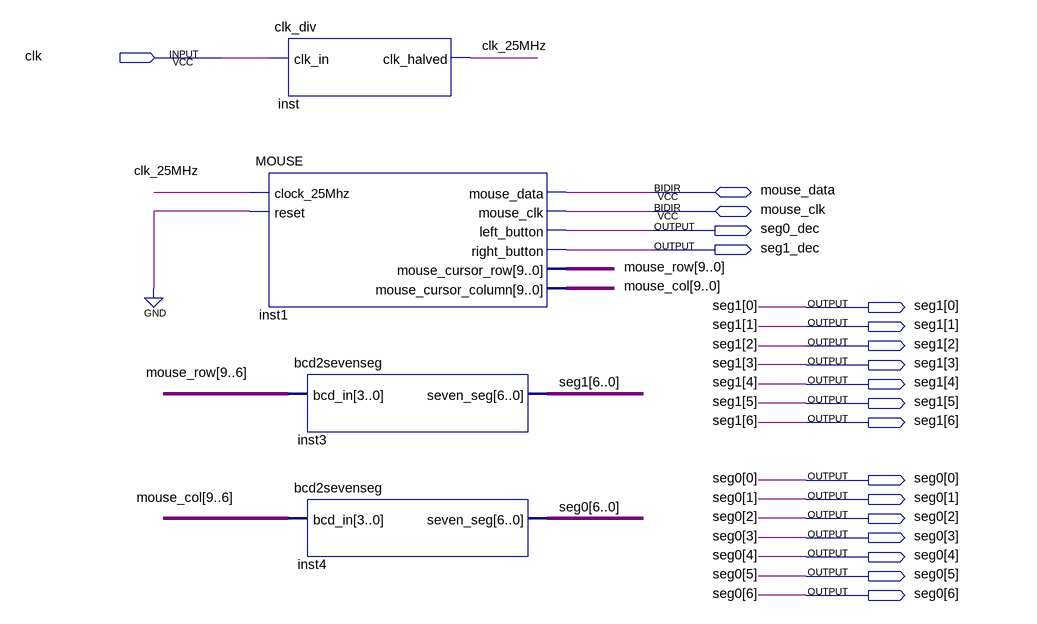
[diagram p0: schematic sheet]
// Quartus schematic PS2_mouse_example.bdf as structural Verilog: 4 symbols, 19 pins
module PS2_mouse_example (
  input  clk,
  inout  mouse_data,
  inout  mouse_clk,
  output seg0_dec,
  output seg1_dec,
  output [6:0] seg1,
  output [6:0] seg0
);

  wire clk_25MHz;
  wire [9:0] mouse_col, mouse_row;

  clk_div inst (.clk_in(clk), .clk_halved(clk_25MHz));
  MOUSE inst1 (
    .clock_25Mhz(clk_25MHz), .reset(1'b0), .left_button(seg0_dec), .right_button(seg1_dec),
    .mouse_cursor_row(mouse_row), .mouse_cursor_column(mouse_col), .mouse_data(mouse_data),
    .mouse_clk(mouse_clk));
  bcd2sevenseg inst3 (.bcd_in(mouse_row[9:6]), .seven_seg(seg1));
  bcd2sevenseg inst4 (.bcd_in(mouse_col[9:6]), .seven_seg(seg0));
endmodule
